# EAGLE design M220B (EAGLE 6.6.0)
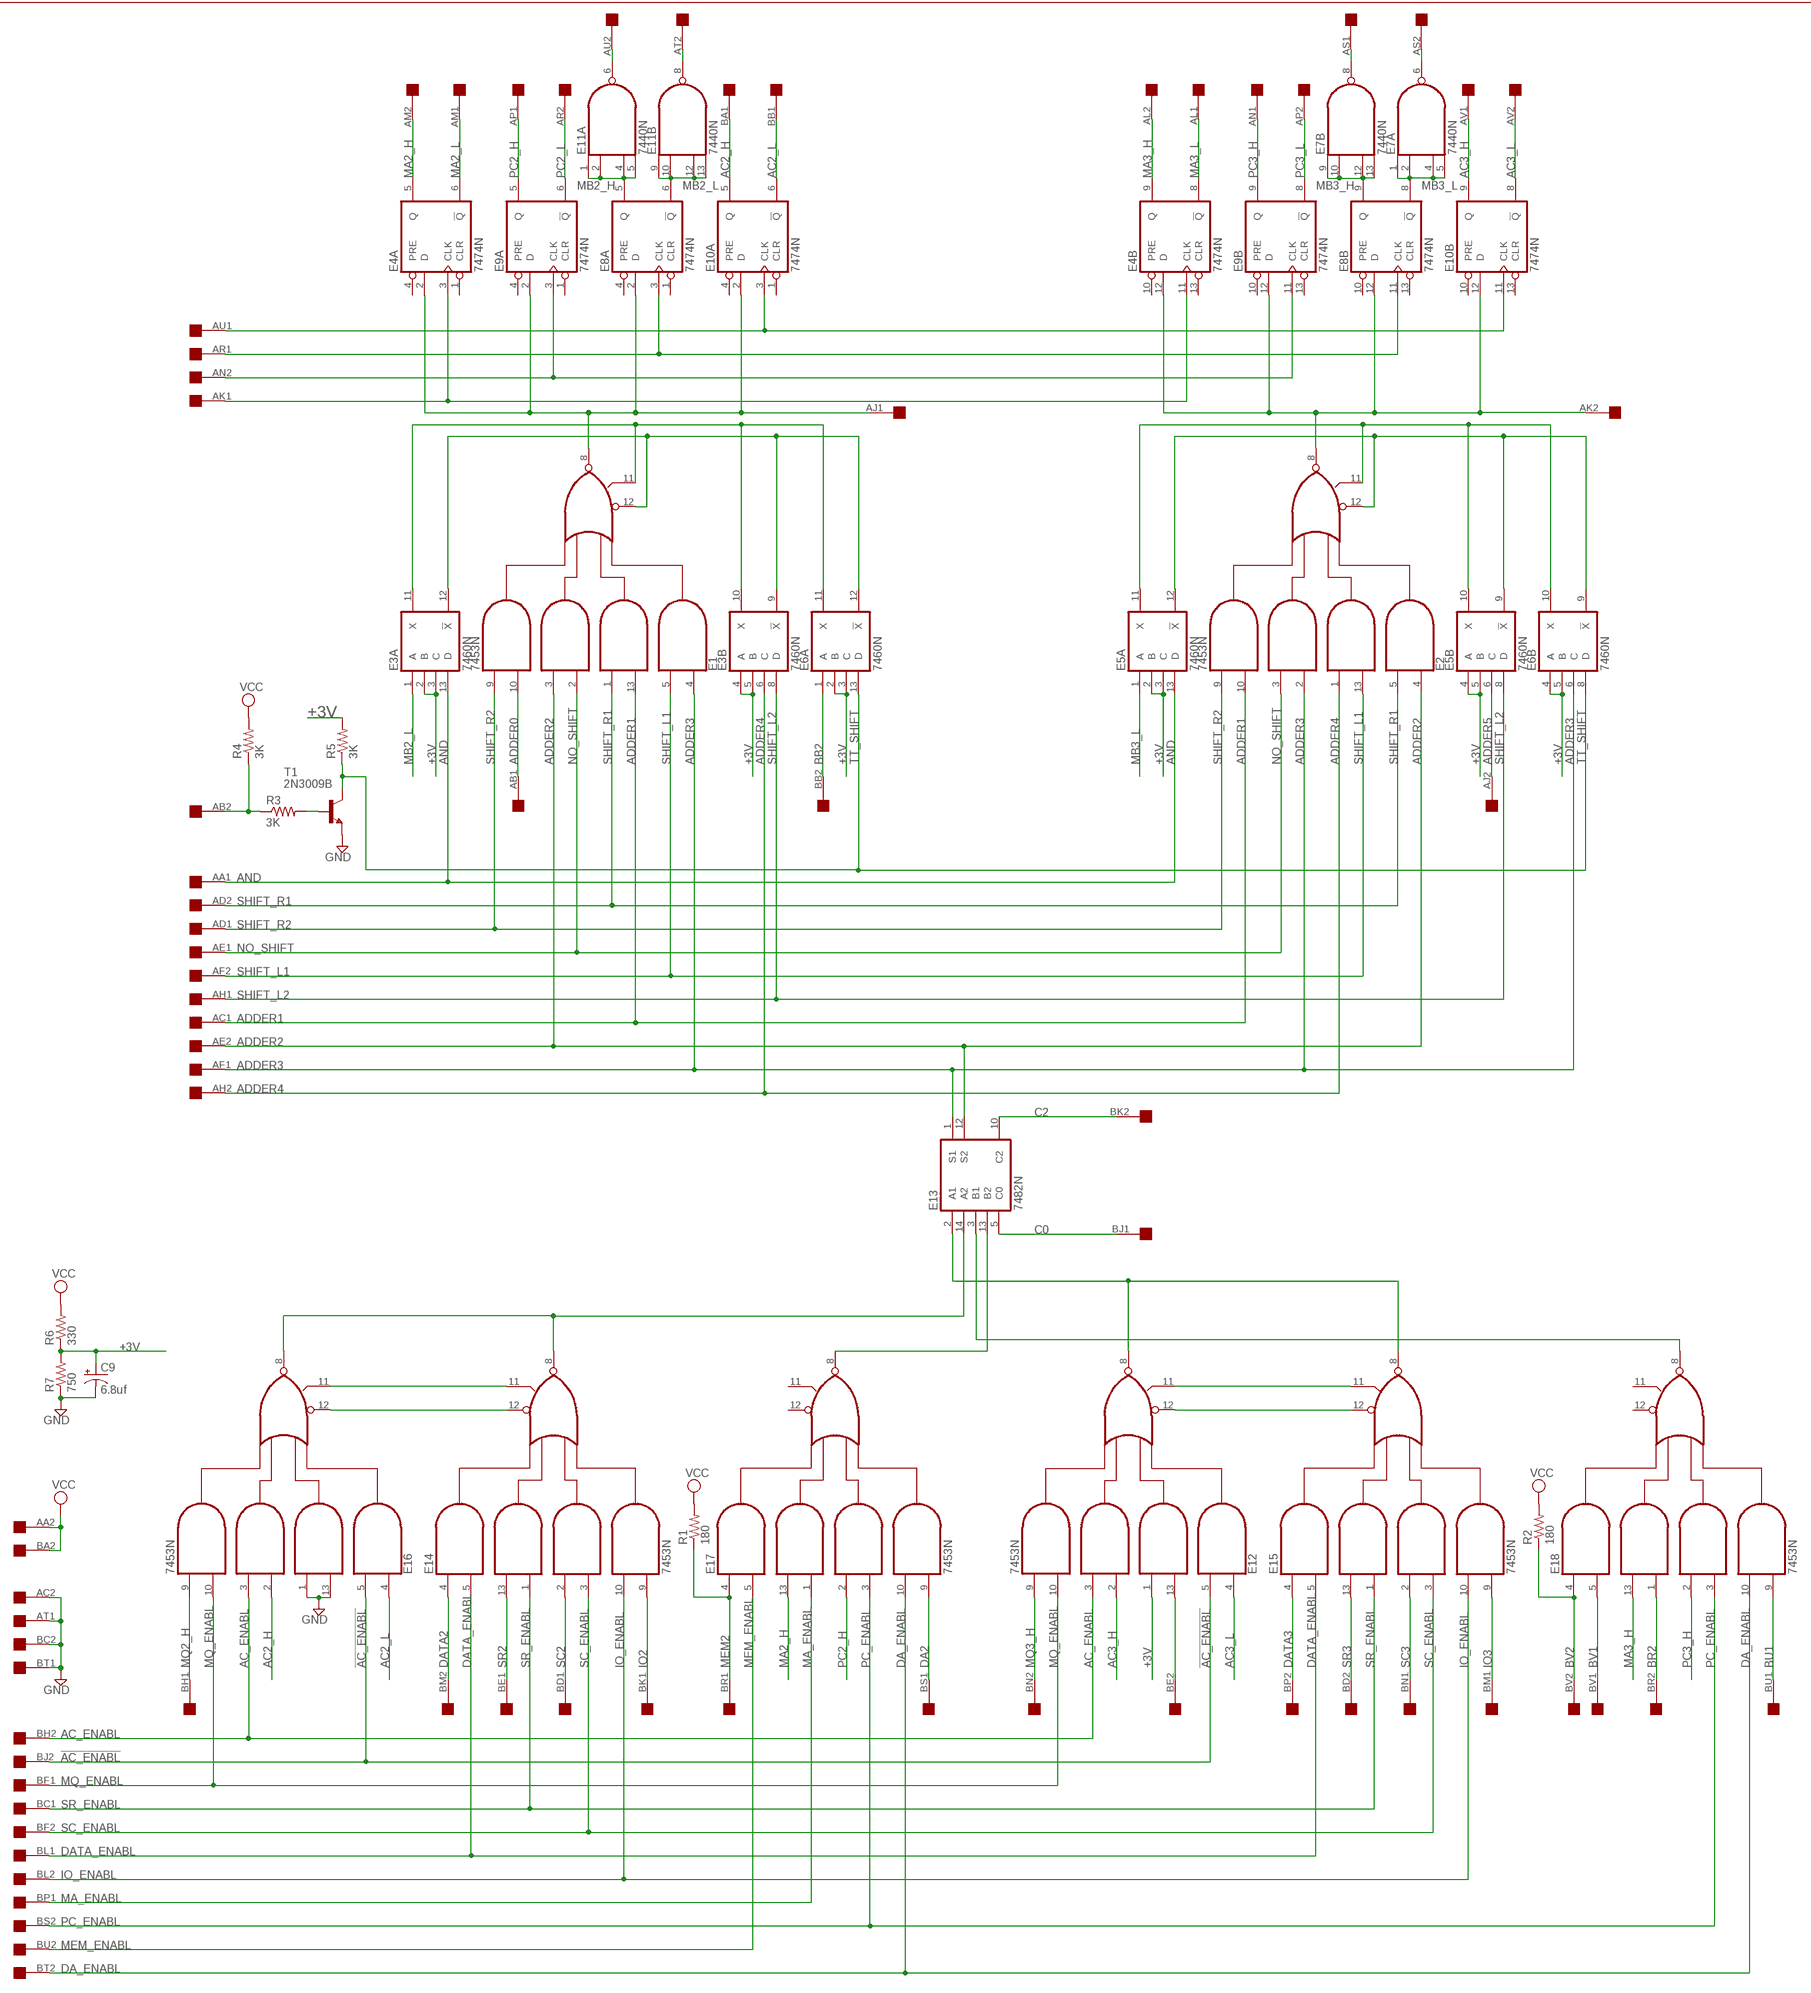
[diagram p0: schematic, sheet 1, part 1 of 2]
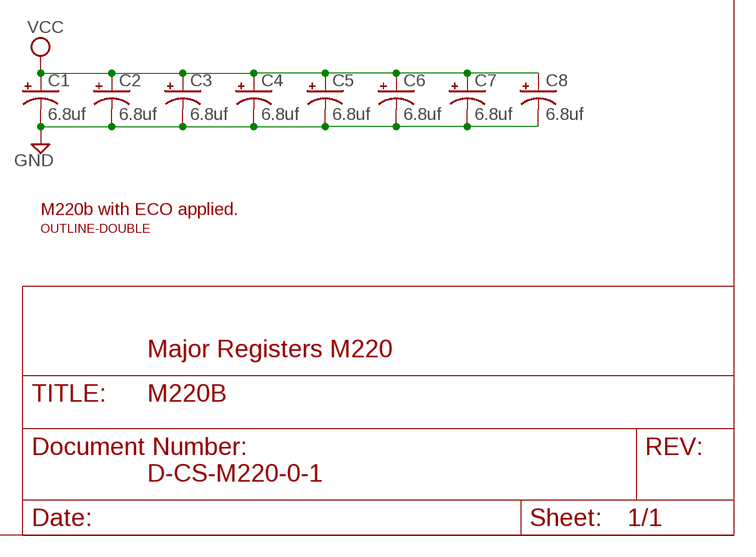
[diagram p1: schematic, sheet 1, part 2 of 2]

## Parts
C1  6.8uf  CPOL-USE15-5AXIAL  [E15-5]
C2  6.8uf  CPOL-USE15-5AXIAL  [E15-5]
C3  6.8uf  CPOL-USE15-5AXIAL  [E15-5]
C4  6.8uf  CPOL-USE15-5AXIAL  [E15-5]
C5  6.8uf  CPOL-USE15-5AXIAL  [E15-5]
C6  6.8uf  CPOL-USE15-5AXIAL  [E15-5]
C7  6.8uf  CPOL-USE15-5AXIAL  [E15-5]
C8  6.8uf  CPOL-USE15-5AXIAL  [E15-5]
C9  6.8uf  CPOL-USE15-5AXIAL  [E15-5]
E1  7453N  [DIL14]
E2  7453N  [DIL14]
E3  7460N  [DIL14]
E4  7474N  74S74N  [DIL14]
E5  7460N  [DIL14]
E6  7460N  [DIL14]
E7  7440N  74S20N  [DIL14]
E8  7474N  74S74N  [DIL14]
E9  7474N  74S74N  [DIL14]
E10  7474N  74S74N  [DIL14]
E11  7440N  74S20N  [DIL14]
E12  7453N  [DIL14]
E13  7482N  [DIL14]
E14  7453N  [DIL14]
E15  7453N  [DIL14]
E16  7453N  [DIL14]
E17  7453N  [DIL14]
E18  7453N  [DIL14]
R1  180  R-US_0207/10  [0207/10]
R2  180  R-US_0207/10  [0207/10]
R3  3K  R-US_0207/10  [0207/10]
R4  3K  R-US_0207/10  [0207/10]
R5  3K  R-US_0207/10  [0207/10]
R6  330  R-US_0207/10  [0207/10]
R7  750  R-US_0207/10  [0207/10]
T1  2N3009B  2N1613  [TO5]
U$1  DOUBLE  [EDGE-CON4]
U$2  OUTLINE-DOUBLE  [DOUBLE]

## Nets
!AC_ENABL: E12.5(I2) E16.5(I2) U$1.BJ2
!TT_SHIFT: R3.1 R4.1 U$1.AB2
+3V: C9.+ E3.2(A:B) E3.3(A:C) E3.4(B:A) E3.5(B:B) E5.2(A:B) E5.3(A:C) E5.4(B:A) E5.5(B:B) E6.2(A:B) E6.3(A:C) E6.4(B:A) E6.5(B:B) E12.1(I4) R5.2 R6.1 R7.2
AC2_H: E10.5(A:Q) E16.2(I5) U$1.BA1
AC2_L: E10.6(A:!Q) E16.4(I1) U$1.BB1
AC3_H: E10.9(B:Q) E12.2(I5) U$1.AV1
AC3_L: E10.8(B:!Q) E12.4(I1) U$1.AV2
AC_ENABL: E12.3(I6) E16.3(I6) U$1.BH2
ADDER0: E1.10(I7) U$1.AB1
ADDER1: E1.13(I3) E2.10(I7) U$1.AC1
ADDER2: E1.3(I6) E2.4(I1) E13.12(S2) U$1.AE2
ADDER3: E1.4(I1) E2.2(I5) E6.6(B:C) E13.1(S1) U$1.AF1
ADDER4: E2.1(I4) E3.6(B:C) U$1.AH2
ADDER5: E5.6(B:C) U$1.AJ2
AJ1: E1.8(O) E4.2(A:D) E8.2(A:D) E9.2(A:D) E10.2(A:D) U$1.AJ1
AK1: E4.3(A:CLK) E4.11(B:CLK) U$1.AK1
AK2: E2.8(O) E4.12(B:D) E8.12(B:D) E9.12(B:D) E10.12(B:D) U$1.AK2
AN2: E9.3(A:CLK) E9.11(B:CLK) U$1.AN2
AND: E3.13(A:D) E5.13(A:D) U$1.AA1
AR1: E8.3(A:CLK) E8.11(B:CLK) U$1.AR1
AS1: E7.8(B:O) U$1.AS1
AS2: E7.6(A:O) U$1.AS2
AT2: E11.8(B:O) U$1.AT2
AU1: E10.3(A:CLK) E10.11(B:CLK) U$1.AU1
AU2: E11.6(A:O) U$1.AU2
BB2: E6.1(A:A) U$1.BB2
BE2: E12.13(I3) U$1.BE2
BR2: E18.1(I4) U$1.BR2
BU1: E18.9(I8) U$1.BU1
BV1: E18.5(I2) U$1.BV1
BV2: E18.4(I1) R2.1 U$1.BV2
C0: E13.5(C0) U$1.BJ1
C2: E13.10(C2) U$1.BK2
DA2: E17.9(I8) U$1.BS1
DA_ENABL: E17.10(I7) E18.10(I7) U$1.BT2
DATA2: E14.4(I1) U$1.BM2
DATA3: E15.4(I1) U$1.BP2
DATA_ENABL: E14.5(I2) E15.5(I2) U$1.BL1
GND [Supply]: C1.- C2.- C3.- C4.- C5.- C6.- C7.- C8.- C9.- E16.1(I4) E16.13(I3) R7.1 T1.1(E) U$1.AC2 U$1.AT1 U$1.BC2 U$1.BT1
IO2: E14.9(I8) U$1.BK1
IO3: E15.9(I8) U$1.BM1
IO_ENABL: E14.10(I7) E15.10(I7) U$1.BL2
MA2_H: E4.5(A:Q) E17.13(I3) U$1.AM2
MA2_L: E4.6(A:!Q) U$1.AM1
MA3_H: E4.9(B:Q) E18.13(I3) U$1.AL2
MA3_L: E4.8(B:!Q) U$1.AL1
MA_ENABL: E17.1(I4) U$1.BP1
MB2_H: E8.5(A:Q) E11.1(A:I0) E11.2(A:I1) E11.4(A:I2) E11.5(A:I3)
MB2_L: E3.1(A:A) E8.6(A:!Q) E11.9(B:I0) E11.10(B:I1) E11.12(B:I2) E11.13(B:I3)
MB3_H: E7.9(B:I0) E7.10(B:I1) E7.12(B:I2) E7.13(B:I3) E8.9(B:Q)
MB3_L: E5.1(A:A) E7.1(A:I0) E7.2(A:I1) E7.4(A:I2) E7.5(A:I3) E8.8(B:!Q)
MEM2: E17.4(I1) R1.1 U$1.BR1
MEM_ENABL: E17.5(I2) U$1.BU2
MQ2_H: E16.9(I8) U$1.BH1
MQ3_H: E12.9(I8) U$1.BN2
MQ_ENABL: E12.10(I7) E16.10(I7) U$1.BF1
N$2: E12.12(I9) E15.12(I9)
N$3: R3.2 T1.2(B)
N$4: E12.11(I10) E15.11(I10)
N$5: E13.14(A2) E14.8(O) E16.8(O)
N$6: E14.11(I10) E16.11(I10)
N$7: E14.12(I9) E16.12(I9)
N$8: E12.8(O) E13.2(A1) E15.8(O)
N$9: E2.12(I9) E5.9(B:!X) E5.12(A:!X) E6.9(B:!X)
N$10: E1.12(I9) E3.9(B:!X) E3.12(A:!X) E6.12(A:!X)
N$11: E2.11(I10) E5.10(B:X) E5.11(A:X) E6.10(B:X)
N$12: E13.13(B2) E17.8(O)
N$13: E1.11(I10) E3.10(B:X) E3.11(A:X) E6.11(A:X)
N$14: E13.3(B1) E18.8(O)
NO_SHIFT: E1.2(I5) E2.3(I6) U$1.AE1
PC2_H: E9.5(A:Q) E17.2(I5) U$1.AP1
PC2_L: E9.6(A:!Q) U$1.AR2
PC3_H: E9.9(B:Q) E18.2(I5) U$1.AN1
PC3_L: E9.8(B:!Q) U$1.AP2
PC_ENABL: E17.3(I6) E18.3(I6) U$1.BS2
SC2: E14.2(I5) U$1.BD1
SC3: E15.2(I5) U$1.BN1
SC_ENABL: E14.3(I6) E15.3(I6) U$1.BF2
SHIFT_L1: E1.5(I2) E2.13(I3) U$1.AF2
SHIFT_L2: E3.8(B:D) E5.8(B:D) U$1.AH1
SHIFT_R1: E1.1(I4) E2.5(I2) U$1.AD2
SHIFT_R2: E1.9(I8) E2.9(I8) U$1.AD1
SR2: E14.13(I3) U$1.BE1
SR3: E15.13(I3) U$1.BD2
SR_ENABL: E14.1(I4) E15.1(I4) U$1.BC1
TT_SHIFT: E6.8(B:D) E6.13(A:D) R5.1 T1.3(C)
VCC [Supply]: C1.+ C2.+ C3.+ C4.+ C5.+ C6.+ C7.+ C8.+ R1.2 R2.2 R4.2 R6.2 U$1.AA2 U$1.BA2
Unconnected: E1.6(SPARE) E2.6(SPARE) E4.1(A:CLR) E4.4(A:PRE) E4.10(B:PRE) E4.13(B:CLR) E8.1(A:CLR) E8.4(A:PRE) E8.10(B:PRE) E8.13(B:CLR) E9.1(A:CLR) E9.4(A:PRE) E9.10(B:PRE) E9.13(B:CLR) E10.1(A:CLR) E10.4(A:PRE) E10.10(B:PRE) E10.13(B:CLR) E12.6(SPARE) E13.6 E13.7 E13.8 E13.9 E14.6(SPARE) E15.6(SPARE) E16.6(SPARE) E17.6(SPARE) E17.11(I10) E17.12(I9) E18.6(SPARE) E18.11(I10) E18.12(I9)

## Notes on the sheet
- M220b with ECO applied.
- Major Registers M220
- D-CS-M220-0-1

## Power pins joined to a net without a drawn wire
GND: E1.7(GND) E2.7(GND) E3.7(P:GND) E4.7(P:GND) E5.7(P:GND) E6.7(P:GND) E7.7(P:GND) E8.7(P:GND) E9.7(P:GND) E10.7(P:GND) E11.7(P:GND) E12.7(GND) E13.11(GND) E14.7(GND) E15.7(GND) E16.7(GND) E17.7(GND) E18.7(GND)
VCC: E1.14(VCC) E2.14(VCC) E3.14(P:VCC) E4.14(P:VCC) E5.14(P:VCC) E6.14(P:VCC) E7.14(P:VCC) E8.14(P:VCC) E9.14(P:VCC) E10.14(P:VCC) E11.14(P:VCC) E12.14(VCC) E13.4(VCC) E14.14(VCC) E15.14(VCC) E16.14(VCC) E17.14(VCC) E18.14(VCC)

## Library data of the parts
C1-C8 = dec-con:CPOL-USE15-5AXIAL: 0.5" veresion of an electrolytic
C9 = rcl:CPOL-US: POLARIZED CAPACITOR, American symbol
E1 E2 E12 E14-E18 = dec-con:74*53: 4-2-3-2 input AND OR INVERTER gates
E3 E5 E6 = 74xx-us:74*60: Dual 4-input EXPANDER
E4 E8-E10 = 74xx-us:74*74: Dual D type positive edge triggered FLIP FLOP, preset and clear
E7 E11 = 74xx-us:74*20: Dual 4-input NAND gate
E13 = dec-con:74*82: 2-bit binary full ADDER Has the wrong GND pin in other libraries.
R1-R7 = rcl:R-US_: RESISTOR, American symbol
T1 = transistor:2N1613: NPN TRANSISTOR
U$1 = dec-con:DOUBLE: Double-Height DEC board
U$2 = dec-con:OUTLINE-*: Board outlines for DEC boards.

## Net classes
1 Supply: width 0.813 mm

## Board
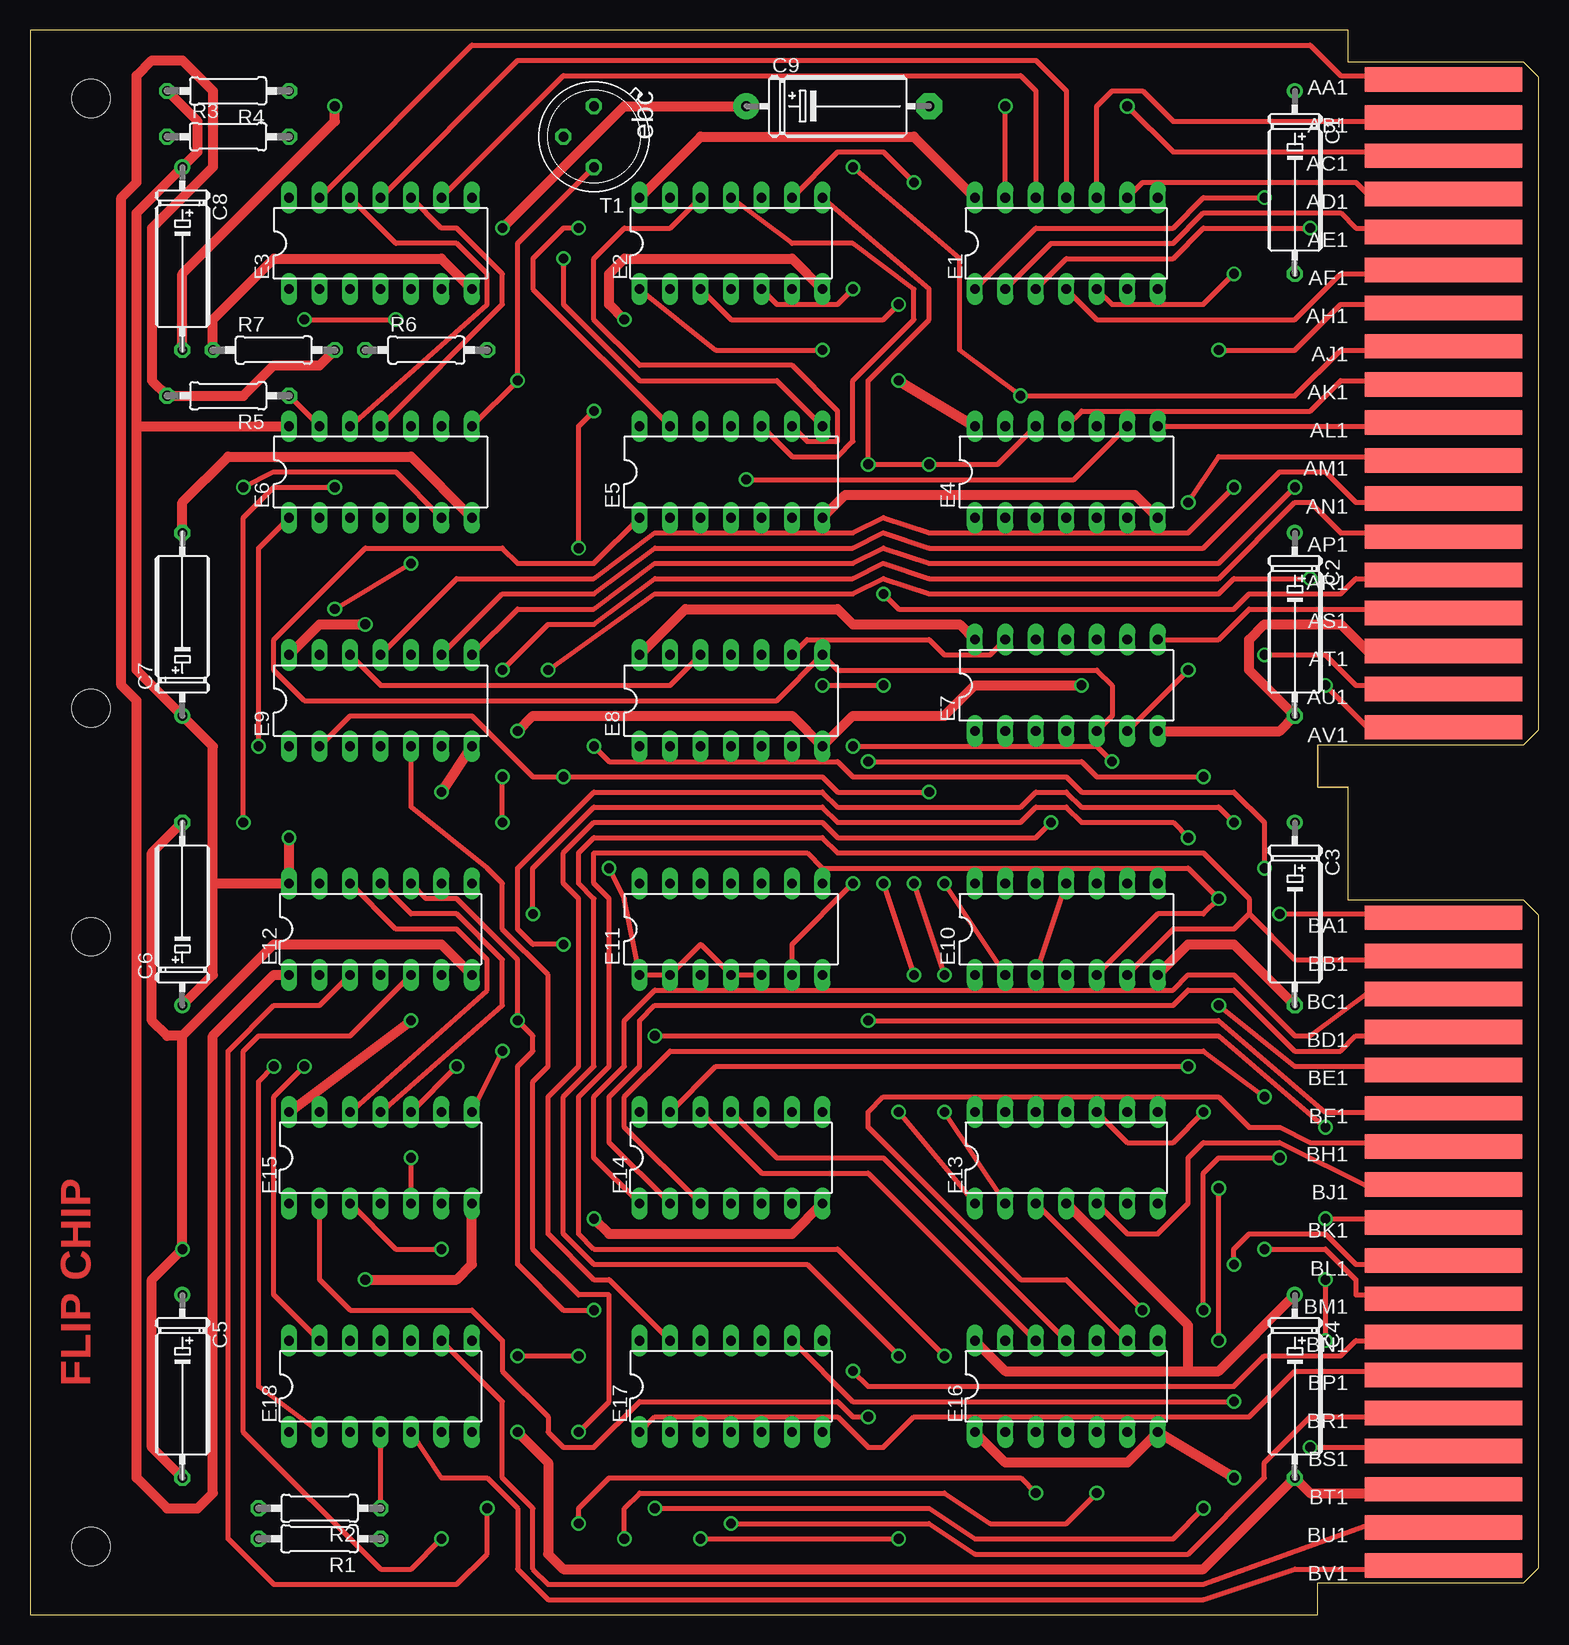
[diagram p2: board, top side]
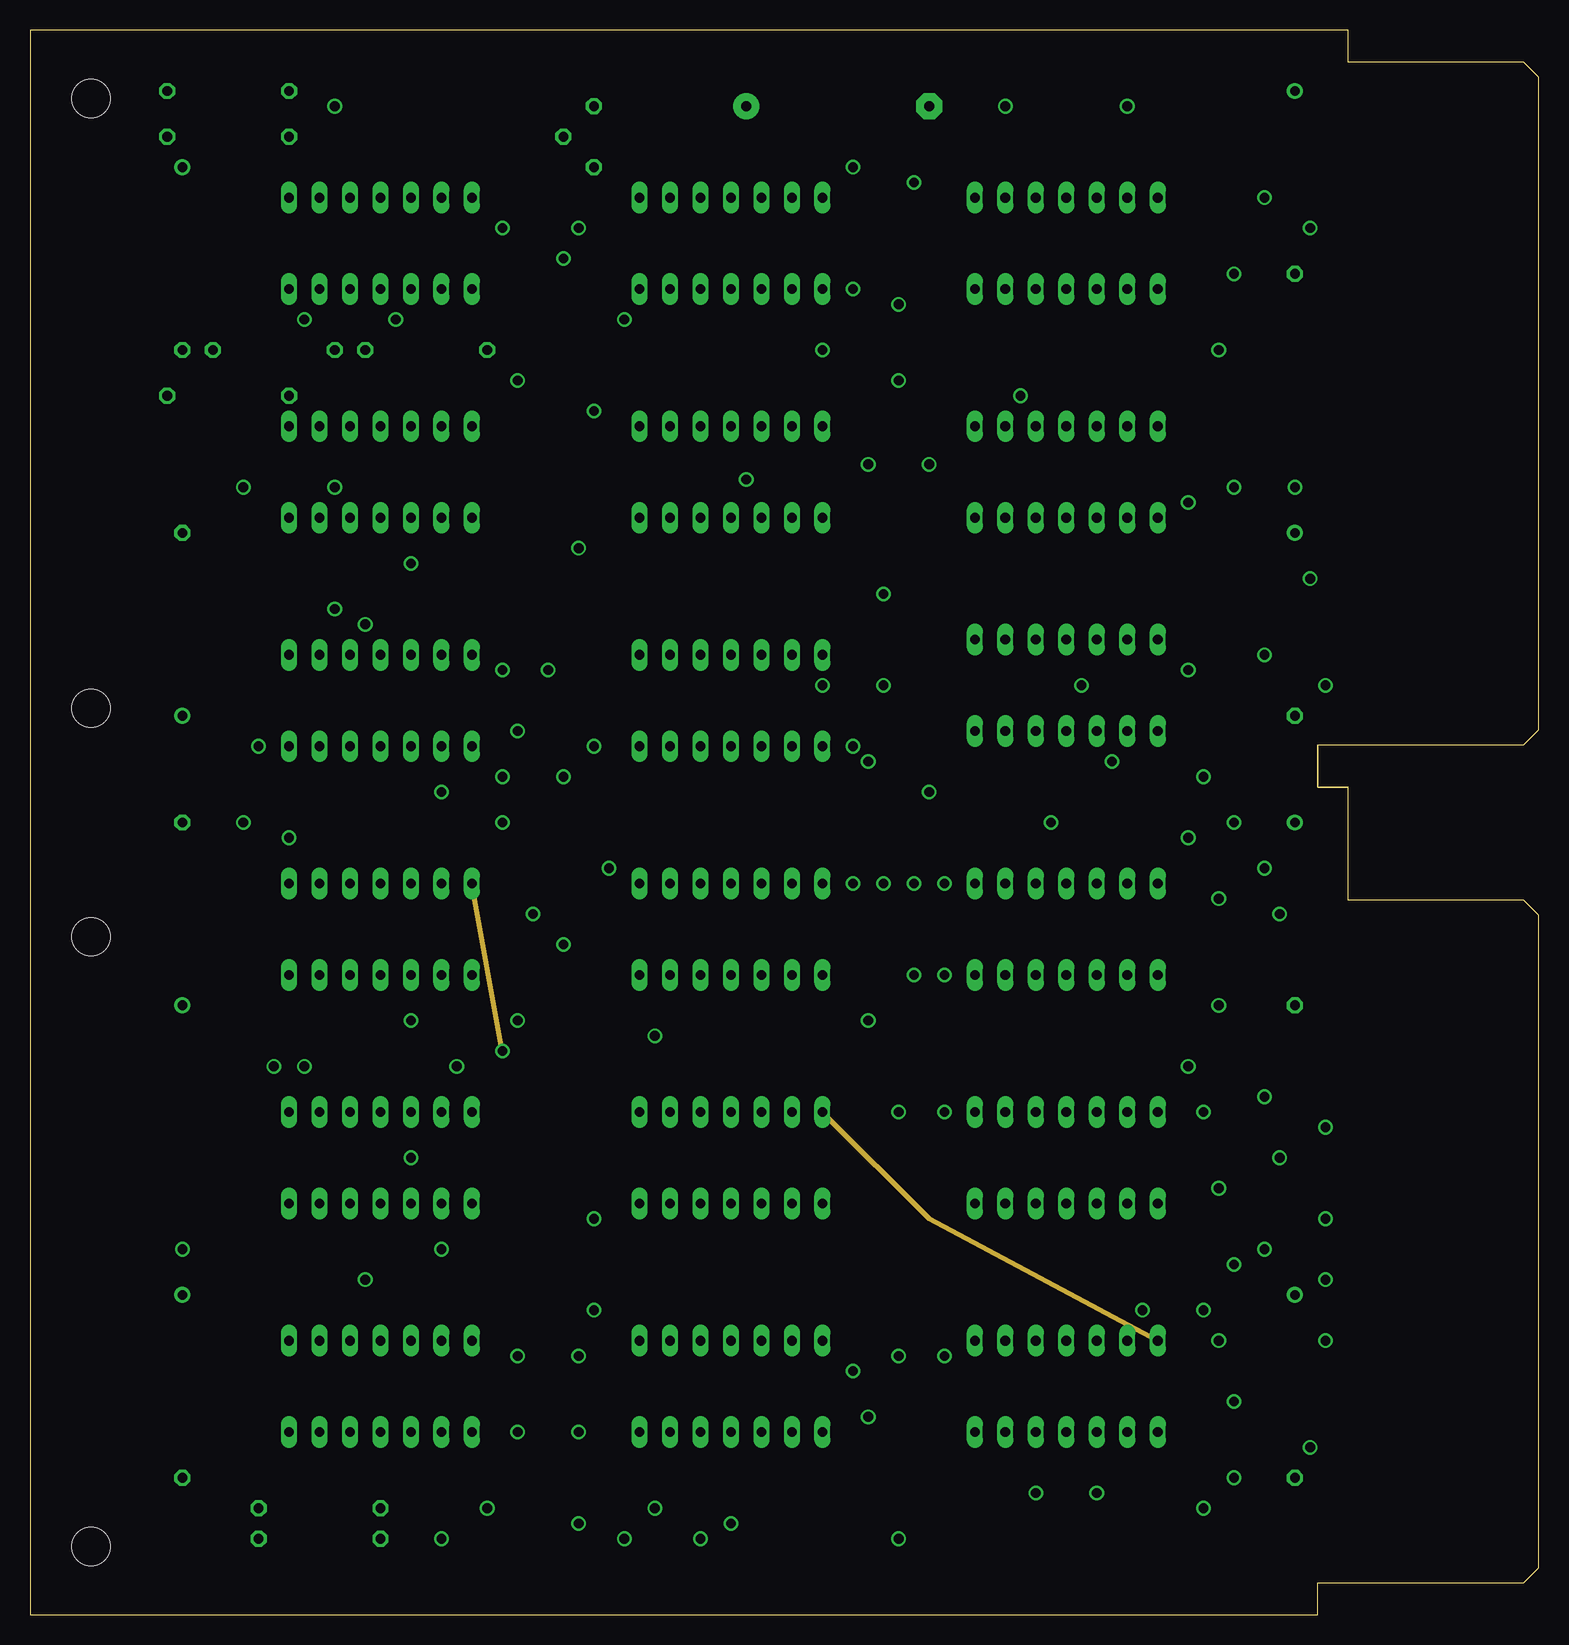
[diagram p3: board, inner layer ECO]
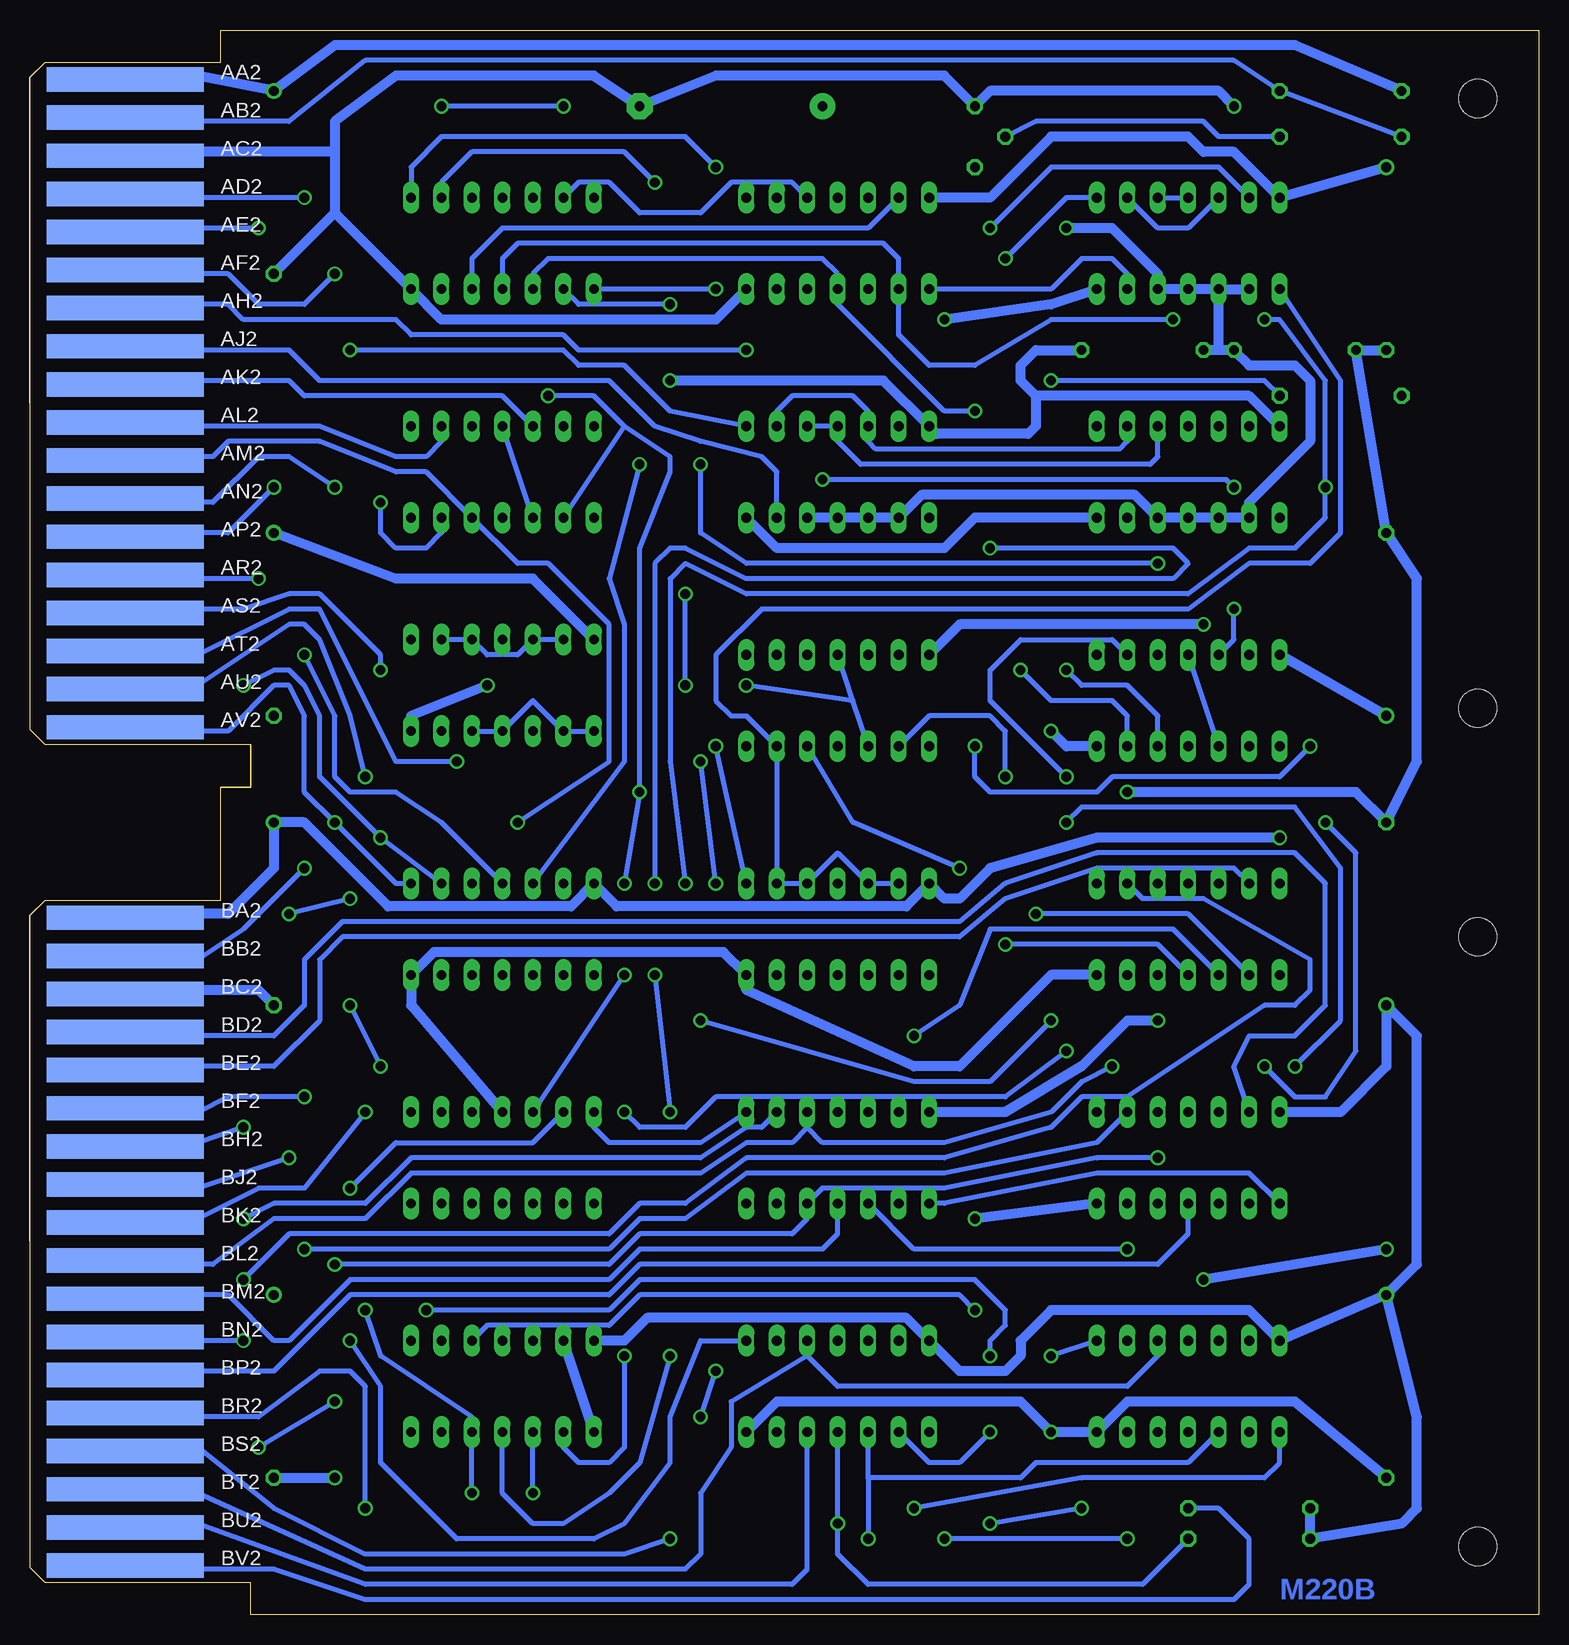
[diagram p4: board, bottom side, seen from below]

Size 125.73 x 132.08 mm. Coordinates in mm from the lower left corner, seen from the top.
Copper layers (1+15+16): Top 0.035mm / dielectric 1.5mm / ECO 0.035mm / dielectric 0.2mm / Bottom 0.035mm
Design rules "16mils *": minimum track width 16mil, minimum drill 32mil, track to track 15mil, track to pad 10mil, pad to pad 10mil, via to via 10mil, smd to smd 10mil, copper to edge 13mil, drill to drill 10mil, minimum pad ring 10mil, minimum via ring 8mil, stop-mask expansion 0mil, vias tented up to drill 0mil, thermal gap 10mil

### Footprints (pad centres in the part's own frame; a part is rotated, then mirrored left to right if it is on the bottom)
E15-5 = drill 0.813: + -7.62,0 | drill 0.813 octagon: - 7.62,0
E15-5' = drill 0.813 pad 2.159: + -7.62,0 | drill 0.813 pad 2.159 octagon: - 7.62,0
DIL14 = drill 0.813 long: 1 -7.62,-3.81; 2 -5.08,-3.81; 3 -2.54,-3.81; 4 0,-3.81; 5 2.54,-3.81; 6 5.08,-3.81; 7 7.62,-3.81; 8 7.62,3.81; 9 5.08,3.81; 10 2.54,3.81; 11 0,3.81; 12 -2.54,3.81; 13 -5.08,3.81; 14 -7.62,3.81
0207/10 = drill 0.813 octagon: 1 -5.08,0; 2 5.08,0
TO5 = drill 0.813 octagon: 1 0,-2.54; 2 2.54,0; 3 0,2.54
EDGE-CON4 = smd 13.106 x 2.032: AA1 7.938,4.128; AB1 7.938,7.303; AC1 7.938,10.477; AD1 7.938,13.652; AE1 7.938,16.828; AF1 7.938,20.003; AH1 7.938,23.177; AJ1 7.938,26.352; AK1 7.938,29.527; AL1 7.938,32.703; AM1 7.938,35.877; AN1 7.938,39.053; AP1 7.938,42.227; AR1 7.938,45.403; AS1 7.938,48.578; AT1 7.938,51.752; AU1 7.938,54.928; AV1 7.938,58.102; BA1 7.938,73.978; BB1 7.938,77.153; BC1 7.938,80.328; BD1 7.938,83.502; BE1 7.938,86.677; BF1 7.938,89.853; BH1 7.938,93.028; BJ1 7.938,96.203; BK1 7.938,99.377; BL1 7.938,102.552; BM1 7.938,105.728; BN1 7.938,108.903; BP1 7.938,112.078; BR1 7.938,115.252; BS1 7.938,118.427; BT1 7.938,121.603; BU1 7.938,124.778; BV1 7.938,127.953 | smd 13.106 x 2.032 bottom: AA2 7.938,4.128; AB2 7.938,7.303; AC2 7.938,10.477; AD2 7.938,13.652; AE2 7.938,16.828; AF2 7.938,20.003; AH2 7.938,23.177; AJ2 7.938,26.352; AK2 7.938,29.527; AL2 7.938,32.703; AM2 7.938,35.877; AN2 7.938,39.053; AP2 7.938,42.227; AR2 7.938,45.403; AS2 7.938,48.578; AT2 7.938,51.752; AU2 7.938,54.928; AV2 7.938,58.102; BA2 7.938,73.978; BB2 7.938,77.153; BC2 7.938,80.328; BD2 7.938,83.502; BE2 7.938,86.677; BF2 7.938,89.853; BH2 7.938,93.028; BJ2 7.938,96.203; BK2 7.938,99.377; BL2 7.938,102.552; BM2 7.938,105.728; BN2 7.938,108.903; BP2 7.938,112.078; BR2 7.938,115.252; BS2 7.938,118.427; BT2 7.938,121.603; BU2 7.938,124.778; BV2 7.938,127.953
DOUBLE = hole 3.175: 120.65,56.515; 120.65,5.715; 120.65,75.565; 120.65,126.365

### Placement (x,y rotation side)
C1  105.41,119.38 270 top
C2  105.41,82.55 270 top
C3  105.41,58.42 270 top
C4  105.41,19.05 270 top
C5  12.7,19.05 270 top
C6  12.7,58.42 90 top
C7  12.7,82.55 90 top
C8  12.7,113.03 270 top
C9  6.8uf  [E15-5']  67.31,125.73 0 top
E1  86.36,114.3 0 top
E2  58.42,114.3 0 top
E3  29.21,114.3 0 top
E4  86.36,95.25 0 top
E5  58.42,95.25 0 top
E6  29.21,95.25 0 top
E7  86.36,77.47 0 top
E8  58.42,76.2 0 top
E9  29.21,76.2 0 top
E10  86.36,57.15 0 top
E11  58.42,57.15 0 top
E12  29.21,57.15 0 top
E13  86.36,38.1 0 top
E14  58.42,38.1 0 top
E15  29.21,38.1 0 top
E16  86.36,19.05 0 top
E17  58.42,19.05 0 top
E18  29.21,19.05 0 top
R1  24.13,6.35 180 top
R2  24.13,8.89 180 top
R3  16.51,123.19 0 top
R4  16.51,127 180 top
R5  16.51,101.6 180 top
R6  33.02,105.41 0 top
R7  20.32,105.41 0 top
T1  46.99,123.19 180 top
U$1  125.73,132.08 180 top
U$2  125.73,132.08 180 top
U$3  [FLIPCHIP]  0,0 0 top

### Tracks (layer width: path | path; a pad name or v marks a point on that pad's centre or on a via)
!AC_ENABL  (via drill 0.81)
  Top 0.406: v88.9,10.16 86.36,7.62 80.01,7.62 76.2,10.16 50.8,10.16 49.53,8.89 v49.53,6.35 | v34.29,6.35 31.75,3.81 29.21,3.81 17.78,15.24 17.78,46.99 19.05,48.26 26.67,48.26 E12.5 | v104.14,38.1 99.06,38.1 97.79,36.83 v97.79,25.4
  Bottom 0.406: v88.9,10.16 E16.5 88.9,16.51 96.52,21.59 v97.79,25.4 | U$1.BJ2 116.84,35.56 111.76,35.56 v104.14,38.1 | v34.29,6.35 v49.53,6.35
!TT_SHIFT
  Bottom 0.406: R3.1 R4.1 25.4,129.54 97.79,129.54 104.14,124.46 115.57,124.46
  Bottom 0.813: 115.57,124.46 U$1.AB2
+3V  (via drill 0.81)
  Top 0.813: C9.+ 49.53,125.73 v39.37,115.57 | R7.2 24.13,104.14 20.32,104.14 17.78,101.6 R5.2 10.16,102.87 10.16,115.57 15.24,120.65 15.24,127 12.7,129.54 10.16,129.54 8.89,128.27 8.89,119.38 7.62,118.11 7.62,77.47 8.89,76.2 8.89,11.43 11.43,8.89 13.97,8.89 15.24,10.16 15.24,48.26 20.32,53.34 E12.1
  Bottom 0.813: v39.37,115.57 35.56,115.57 31.75,111.76 E3.5 E3.4 E3.3 | E3.3 E3.2 | 26.67,105.41 R7.2 24.13,104.14 20.32,104.14 19.05,102.87 19.05,97.79 24.13,92.71 E6.2 E6.3 E6.4 E6.5 33.66,93.34 51.44,93.34 E5.2 E5.3 E5.4 E5.5 | 26.67,105.41 R6.1 | 26.67,105.41 E3.3
AC2_H  (via drill 0.81)
  Top 0.406: U$1.BA1 116.84,58.42 v104.14,58.42 | v76.2,21.59 67.31,30.48 46.99,30.48 45.72,31.75 45.72,43.18 48.26,45.72 48.26,59.69 46.99,60.96 46.99,63.5 64.77,63.5 66.04,62.23 96.52,62.23 v99.06,59.69 97.79,58.42 93.98,58.42 E10.5
  Bottom 0.406: E16.2 81.28,13.97 80.01,12.7 77.47,12.7 76.2,13.97 v76.2,21.59 | v99.06,59.69 v104.14,58.42
AC2_L  (via drill 0.81)
  Top 0.406: U$1.BB1 116.84,54.61 105.41,54.61 101.6,58.42 | 101.6,58.42 101.6,59.69 97.79,63.5 67.31,63.5 66.04,64.77 46.99,64.77 45.72,63.5 45.72,60.96 46.99,59.69 46.99,45.72 44.45,43.18 44.45,31.75 46.99,29.21 64.77,29.21 v72.39,21.59 | E10.6 95.25,57.15 100.33,57.15 101.6,58.42
  Bottom 0.406: E16.4 86.36,10.16 83.82,7.62 81.28,7.62 77.47,10.16 74.93,12.7 v72.39,21.59
AC3_H  (via drill 0.81)
  Top 0.406: U$1.AV1 117.67,73.66 111.76,73.66 v107.95,77.47 | v96.52,64.77 95.25,66.04 87.63,66.04 86.36,67.31 83.82,67.31 82.55,66.04 67.31,66.04 66.04,67.31 46.99,67.31 41.91,62.23 v41.91,58.42
  Bottom 0.406: E10.9 v96.52,64.77 101.6,69.85 101.6,74.93 102.87,77.47 104.14,78.74 105.41,78.74 v107.95,77.47 | E12.2 29.21,58.42 v41.91,58.42
AC3_L  (via drill 0.81)
  Top 0.406: v100.33,66.04 99.06,67.31 87.63,67.31 86.36,68.58 83.82,68.58 82.55,67.31 67.31,67.31 66.04,68.58 46.99,68.58 40.64,62.23 40.64,57.15 41.91,55.88 v44.45,55.88
  Bottom 0.406: U$1.AV2 117.23,74.05 116.84,73.66 109.22,73.66 105.41,77.47 104.14,77.47 102.87,74.93 102.87,68.58 v100.33,66.04 95.25,60.96 E10.8 | E12.4 31.75,55.88 v44.45,55.88
AC_ENABL  (via drill 0.81)
  Top 0.406: v83.82,10.16 82.55,11.43 48.26,11.43 45.72,8.89 v45.72,7.62 | E12.3 24.13,50.8 20.32,50.8 16.51,46.99 16.51,6.35 20.32,2.54 35.56,2.54 38.1,5.08 v38.1,8.89 | v52.07,48.26 99.06,48.26 v107.95,40.64
  Bottom 0.406: E12.3 30.48,57.15 45.72,57.15 48.26,50.8 v52.07,48.26 | v83.82,10.16 E16.3 | U$1.BH2 116.84,39.37 111.76,39.37 v107.95,40.64 | v38.1,8.89 v45.72,7.62
ADDER0
  Top 0.406: 116.84,124.46 95.25,124.46 92.71,127 90.17,127 88.9,125.73 E1.10
  Top 0.813: 116.84,124.46 U$1.AB1
ADDER1  (via drill 0.81)
  Top 0.406: E1.13 v81.28,125.73 | U$1.AC1 116.84,121.92 95.25,121.92 v91.44,125.73
  Bottom 0.406: v81.28,125.73 v91.44,125.73 | E1.13 80.01,119.38 77.47,119.38 74.93,116.84 69.85,116.84 67.31,119.38 62.23,119.38 E2.10
ADDER2  (via drill 0.81)
  Top 0.406: v46.99,100.33 45.72,99.06 v45.72,88.9 | v106.68,115.57 97.79,115.57 95.25,113.03 86.36,113.03 E1.3 | v73.66,60.96 v76.2,53.34
  Bottom 0.406: E1.3 83.82,111.76 82.55,113.03 59.69,113.03 58.42,111.76 E2.4 58.42,109.22 49.53,100.33 v46.99,100.33 | U$1.AE2 114.63,115.24 114.3,115.57 v106.68,115.57 | v76.2,53.34 E13.12 | v45.72,88.9 30.48,88.9 29.21,87.63 30.48,86.36 66.04,86.36 71.12,88.9 72.39,88.9 73.66,87.63 v73.66,60.96
ADDER3  (via drill 0.81)
  Top 0.406: v22.86,107.95 v30.48,107.95 | U$1.AF1 115.57,111.76 109.22,111.76 105.41,107.95 88.9,107.95 E1.4 | E6.6 30.48,95.25 20.32,95.25 v17.78,93.98 | v71.12,60.96 v73.66,53.34 | v72.39,41.91 E13.1
  Bottom 0.406: E1.4 86.36,113.03 85.09,114.3 54.61,114.3 53.34,113.03 E2.2 53.34,106.68 50.8,104.14 46.99,104.14 40.64,107.95 v30.48,107.95 | v22.86,107.95 21.59,107.95 17.78,102.87 v17.78,93.98 17.78,91.44 20.32,88.9 24.13,88.9 29.21,85.09 66.04,85.09 71.12,87.63 72.39,86.36 72.39,71.12 v71.12,60.96 | v73.66,53.34 v72.39,41.91
ADDER4  (via drill 0.81)
  Top 0.406: v66.04,105.41 57.15,105.41 E2.1
  Bottom 0.406: E3.6 34.29,111.76 35.56,113.03 38.1,113.03 40.64,110.49 E2.1 | U$1.AH2 115.9,108.89 115.57,109.22 109.22,109.22 107.95,107.95 95.25,107.95 93.98,106.68 81.28,106.68 80.01,105.41 v66.04,105.41
ADDER5
  Bottom 0.406: U$1.AJ2 117.17,105.74 116.84,105.41 104.14,105.41 101.6,102.87 77.47,102.87 73.66,99.06 69.85,97.79 64.77,96.52 63.5,95.25 E5.6
AJ1  (via drill 0.81)
  Top 0.406: v68.58,120.65 77.47,113.03 77.47,105.41 v82.55,101.6 105.41,101.6 109.22,105.41 116.84,105.41 U$1.AJ1 | v74.93,68.58 67.31,68.58 66.04,69.85 v44.45,69.85 41.91,69.85 36.83,74.93 26.67,74.93 E9.2 | v76.2,60.96 E10.2
  Bottom 0.406: E1.8 93.98,120.65 91.44,123.19 71.12,123.19 v68.58,120.65 | E8.2 50.8,74.93 45.72,74.93 44.45,73.66 v44.45,69.85 | 76.2,99.06 E4.2 | 76.2,99.06 78.74,101.6 v82.55,101.6 | 76.2,99.06 72.39,96.52 72.39,95.25 74.93,88.9 v74.93,68.58 v76.2,60.96
AK1
  Top 0.406: U$1.AK1 116.84,102.87 109.22,102.87 106.68,100.33 87.63,100.33 E4.11
  Bottom 0.406: E4.3 E4.11
AK2  (via drill 0.81)
  Top 0.406: v25.4,83.82 v31.75,87.63 | E4.12 80.64,95.89 v74.93,95.89 v69.85,95.89 69.85,102.87 74.93,107.95 74.93,110.49 E2.8 | E8.12 53.34,77.47 29.21,77.47 E9.12
  Bottom 0.406: U$1.AK2 115.88,102.56 115.57,102.87 104.14,102.87 102.87,101.6 86.36,101.6 E4.12 | E9.12 25.4,81.28 v25.4,83.82 | E10.12 76.2,71.12 76.2,82.55 77.47,86.36 v74.93,95.89 | v31.75,87.63 66.04,87.63 69.85,90.17 v69.85,95.89
AN2  (via drill 0.81)
  Top 0.406: v100.33,93.98 96.52,90.17 74.93,90.17 71.12,91.44 68.58,90.17 52.07,90.17 46.99,86.36 35.56,86.36 E9.11
  Bottom 0.406: E9.3 E9.11 | U$1.AN2 115.9,93.04 115.57,92.71 110.49,92.71 106.68,96.52 104.14,96.52 v100.33,93.98
AND  (via drill 0.81)
  Top 0.406: U$1.AA1 117.24,127.87 116.84,128.27 109.22,128.27 106.68,130.81 36.83,130.81 E3.13 | E5.13 41.91,110.49 41.91,113.03 44.45,115.57 v45.72,115.57
  Bottom 0.406: E3.13 26.67,120.65 40.64,120.65 v45.72,115.57
AR1  (via drill 0.81)
  Top 0.406: v66.04,77.47 v71.12,77.47 | v71.12,85.09 72.39,83.82 100.33,83.82 101.6,85.09 109.22,85.09 110.49,86.36 116.84,86.36 U$1.AR1
  Bottom 0.406: E8.3 57.15,76.2 | 57.15,76.2 E8.11 | 57.15,76.2 v66.04,77.47 | v71.12,77.47 v71.12,85.09
AS1
  Top 0.406: U$1.AS1 116.84,83.82 101.6,83.82 99.06,81.28 E7.8
AS2  (via drill 0.81)
  Top 0.406: E7.6 v96.52,78.74
  Bottom 0.406: U$1.AS2 117.14,83.52 116.84,83.82 107.95,83.82 104.14,85.09 101.6,85.09 96.52,80.01 v96.52,78.74
AT2  (via drill 0.81)
  Top 0.406: v90.17,71.12 88.9,72.39 v68.58,72.39
  Bottom 0.406: E11.8 v68.58,72.39 | U$1.AT2 116.84,80.01 111.76,80.01 104.14,83.82 101.6,83.82 95.25,71.12 v90.17,71.12
AU1  (via drill 0.81)
  Top 0.406: U$1.AU1 117.71,77.47 110.49,77.47 107.95,80.01 v102.87,80.01 | E10.3 E10.11
  Bottom 0.406: v102.87,80.01 100.33,74.93 100.33,69.85 99.06,68.58 95.25,68.58 91.44,66.04 E10.11
AU2  (via drill 0.81)
  Top 0.406: v97.79,69.85 88.9,69.85 87.63,71.12 v69.85,71.12 | v68.58,60.96 63.5,55.88 E11.6
  Bottom 0.406: U$1.AU2 116.84,77.47 111.76,77.47 104.14,82.55 102.87,82.55 101.6,81.28 99.06,74.93 v97.79,69.85 | v68.58,60.96 v69.85,71.12
BB2  (via drill 0.81)
  Top 0.406: E6.1 19.05,88.9 v19.05,72.39 | v46.99,72.39 48.26,71.12 67.31,71.12 68.58,69.85 86.36,69.85 87.63,68.58 100.33,68.58 102.87,66.04 v102.87,62.23
  Bottom 0.406: U$1.BB2 116.84,54.61 111.76,54.61 107.95,57.15 v102.87,62.23 | v19.05,72.39 21.59,69.85 35.56,69.85 36.83,68.58 45.72,68.58 46.99,69.85 v46.99,72.39
BE2
  Bottom 0.406: U$1.BE2 116.84,45.72 105.41,45.72 101.6,49.53 101.6,54.61 99.69,56.52 48.26,56.52 44.45,59.69 36.83,62.23 25.4,62.23 E12.13
BR2  (via drill 0.81)
  Top 0.406: v52.07,8.89 74.93,8.89 78.74,6.35 95.25,6.35 v97.79,8.89
  Bottom 0.406: E18.1 21.59,12.7 22.86,11.43 38.1,11.43 v52.07,8.89 | U$1.BR2 116.84,16.51 106.68,16.51 101.6,20.32 99.06,20.32 97.79,19.05 v97.79,8.89
BU1
  Top 0.406: U$1.BU1 116.84,7.62 111.76,7.62 97.79,2.54 43.18,2.54 41.91,3.81 41.91,8.89 39.37,11.43 39.37,17.78 E18.9
BV1
  Top 0.406: U$1.BV1 116.84,3.81 105.41,3.81 97.79,1.27 43.18,1.27 40.64,3.81 40.64,8.89 38.1,11.43 34.29,11.43 E18.5
BV2
  Top 0.406: R2.1 E18.4
  Bottom 0.406: U$1.BV2 117.23,4.2 116.84,3.81 105.41,3.81 97.79,1.27 25.4,1.27 24.13,2.54 24.13,6.35 26.67,8.89 R2.1
C0
  Top 0.406: U$1.BJ1 117.73,35.56 111.76,35.56 104.14,39.37 97.79,39.37 96.52,38.1 96.52,34.29 93.98,31.75 91.44,31.75 E13.5
C2  (via drill 0.81)
  Top 0.406: v97.79,41.91 95.25,39.37 91.44,39.37 E13.10
  Bottom 0.406: U$1.BK2 116.84,33.02 111.76,33.02 106.68,35.56 102.87,35.56 v97.79,41.91
DA2  (via drill 0.81)
  Top 0.406: U$1.BS1 116.84,13.97 v106.68,13.97 | v100.33,17.78 68.58,17.78 E17.9
  Bottom 0.406: v100.33,17.78 v106.68,13.97
DA_ENABL
  Bottom 0.406: U$1.BT2 116.84,10.16 111.76,10.16 97.79,3.81 71.12,3.81 69.85,5.08 69.85,10.16 67.31,13.97 67.31,17.78 60.96,21.59 | 60.96,21.59 E17.10 | E18.10 31.75,21.59 34.29,19.05 58.42,19.05 60.96,21.59
DATA2
  Bottom 0.406: U$1.BM2 116.84,26.67 109.22,26.67 105.41,22.86 104.14,22.86 99.06,27.94 77.47,27.94 74.93,30.48 59.69,30.48 58.42,31.75 E14.4
DATA3
  Bottom 0.406: U$1.BP2 115.57,20.32 105.41,20.32 99.06,26.67 77.47,26.67 74.93,29.21 31.75,29.21 29.21,31.75 E15.4
DATA_ENABL  (via drill 0.81)
  Top 0.406: E15.5 v31.75,38.1 | U$1.BL1 117.71,29.21 110.49,29.21 107.95,31.75 101.6,31.75 100.33,30.48 v100.33,29.21
  Bottom 0.406: v100.33,29.21 77.47,29.21 74.93,31.75 62.23,31.75 60.96,33.02 E14.5 59.69,35.56 49.53,35.56 36.83,38.1 v31.75,38.1
GND  (via drill 0.81)
  Top 0.813: v100.33,11.43 E16.7 91.44,12.7 81.28,12.7 E16.1 | U$1.BT1 116.84,10.16 106.68,10.16 C4.- 97.79,3.81 44.45,3.81 43.18,5.08 43.18,12.7 v40.64,15.24 | v46.99,33.02 48.26,31.75 63.5,31.75 E14.7 | v25.4,125.73 25.4,124.46 12.7,111.76 C8.- | E3.7 34.29,113.03 20.32,113.03 15.24,107.95 R7.1 | v34.29,68.58 E9.7 | v40.64,73.66 41.91,74.93 63.5,74.93 E8.7 68.58,74.93 76.2,74.93 78.74,77.47 v87.63,77.47 | C5.- 10.16,13.97 10.16,27.94 v12.7,30.48 12.7,48.26 | E15.7 36.83,29.21 35.56,27.94 v27.94,27.94 | E4.7 92.08,93.34 67.94,93.34 E5.7 | C7.- 12.7,92.71 16.51,96.52 31.75,96.52 E6.7 | v49.53,107.95 48.26,109.22 48.26,111.76 49.53,113.03 63.5,113.03 E2.7 | E7.7 104.14,73.66 C2.- 101.6,78.74 101.6,81.28 102.87,82.55 109.22,82.55 111.76,80.01 116.84,80.01 U$1.AT1 | E10.7 96.52,55.88 100.33,55.88 C3.- | E12.7 34.29,55.88 20.32,55.88 12.7,48.26 | 12.7,48.26 11.43,48.26 10.16,49.53 10.16,63.5 C6.-
  Bottom 0.813: C8.- R7.1 C7.- 10.16,86.36 10.16,71.12 C6.- 15.24,68.58 v34.29,68.58 | U$1.AC2 116.84,121.92 100.33,121.92 | 100.33,121.92 100.33,124.46 95.25,128.27 78.74,128.27 C9.- 68.58,128.27 49.53,128.27 T1.1 45.72,127 26.67,127 v25.4,125.73 | 100.33,116.84 C1.- | 100.33,121.92 100.33,116.84 | 100.33,116.84 E1.7 91.44,107.95 68.58,107.95 E2.7 | E3.7 40.64,109.22 v49.53,107.95 | E16.1 E16.13 | E7.7 93.98,74.93 v87.63,77.47 | E9.7 39.37,72.39 v40.64,73.66 | E12.7 40.64,53.34 48.26,45.72 52.07,45.72 66.04,52.07 E11.7 67.94,55.24 92.08,55.24 E10.7 93.98,50.8 E13.11 | U$1.BC2 116.84,52.07 106.68,52.07 C3.- | C4.- v100.33,11.43 | E17.7 63.5,17.78 43.18,17.78 v40.64,15.24 E18.7 34.29,17.78 20.32,17.78 C5.- | E15.7 v46.99,33.02 | E6.7 46.99,91.44 49.53,88.9 63.5,88.9 E5.7 | v12.7,30.48 v27.94,27.94
IO2  (via drill 0.81)
  Top 0.406: U$1.BK1 117.76,33.02 v107.95,33.02
  Bottom 0.406: E14.9 64.77,40.64 66.04,40.64 69.85,38.1 93.98,38.1 97.79,34.29 105.41,34.29 v107.95,33.02
IO3  (via drill 0.81)
  Top 0.406: U$1.BM1 117.71,26.67 110.49,26.67 110.49,27.94 107.95,30.48 v102.87,30.48
  Bottom 0.406: E15.9 36.83,39.37 49.53,36.83 66.04,36.83 71.12,33.02 74.93,33.02 77.47,30.48 v102.87,30.48
IO_ENABL  (via drill 0.81)
  Top 0.406: E15.10 v35.56,45.72
  Bottom 0.406: U$1.BL2 116.84,29.21 110.49,29.21 105.41,33.02 97.79,33.02 93.98,36.83 69.85,36.83 66.04,39.37 62.23,39.37 60.96,40.64 | 60.96,40.64 E14.10 | 60.96,40.64 59.69,39.37 49.53,39.37 40.64,41.91 38.1,44.45 v35.56,45.72
MA2_H  (via drill 0.81)
  Top 0.406: v85.09,66.04 83.82,64.77 67.31,64.77 66.04,66.04 46.99,66.04 44.45,63.5 44.45,60.96 45.72,59.69 45.72,45.72 43.18,43.18 43.18,31.75 46.99,27.94 48.26,27.94 E17.13
  Bottom 0.406: U$1.AM2 117.17,96.19 116.84,96.52 110.49,96.52 109.22,97.79 101.6,97.79 95.25,95.25 92.71,95.25 E4.5 85.09,87.63 82.55,87.63 77.47,82.55 77.47,71.12 v85.09,66.04
MA2_L  (via drill 0.81)
  Top 0.406: U$1.AM1 116.84,96.52 99.06,96.52 v96.52,92.71
  Bottom 0.406: E4.6 91.44,90.17 92.71,88.9 95.25,88.9 96.52,90.17 v96.52,92.71
MA3_H  (via drill 0.81)
  Top 0.406: E18.13 20.32,26.67 20.32,43.18 v22.86,45.72 | v17.78,66.04 17.78,91.44 20.32,93.98 v25.4,93.98 | v59.69,94.61 87,94.61 E4.9
  Bottom 0.406: U$1.AL2 117.17,99.39 116.84,99.06 101.6,99.06 95.25,96.52 92.71,96.52 91.44,97.79 E4.9 | v22.86,45.72 20.32,43.18 17.78,43.18 15.24,46.99 15.24,63.5 v17.78,66.04 | v25.4,93.98 26.04,94.61 v59.69,94.61
MA3_L
  Top 0.406: U$1.AL1 116.84,99.06 E4.8
MA_ENABL
  Top 0.406: U$1.BP1 116.84,20.32 105.41,20.32 101.6,16.51 73.66,16.51 71.12,13.97 69.85,13.97 67.31,16.51 52.07,16.51 E17.1
MB2_H  (via drill 0.81)
  Top 0.406: v48.26,62.23 49.53,59.69 E11.1 E11.2 55.88,55.88 E11.4 E11.5
  Bottom 0.406: E8.5 57.15,66.04 v48.26,62.23
MB2_L
  Bottom 0.406: E3.1 16.51,102.87 16.51,90.17 19.05,87.63 24.13,87.63 29.21,83.82 64.77,83.82 68.58,80.01 68.58,76.2 67.31,74.93 66.04,74.93 E8.6 E11.9 E11.10 58.42,63.5 E11.12 E11.13
MB3_H
  Top 0.406: E8.9 64.77,81.28 74.93,81.28 76.2,80.01 80.01,80.01 E7.13
  Bottom 0.406: E7.9 E7.10 87.63,80.01 85.09,80.01 E7.12 E7.13
MB3_L
  Top 0.406: E5.1 46.99,87.63 40.64,87.63 39.37,88.9 27.94,88.9 20.32,81.28 20.32,78.74 22.86,76.2 62.23,76.2 E8.8 67.31,78.74 88.9,78.74 90.17,77.47 90.17,74.93 E7.5
  Bottom 0.406: E7.5 E7.4 83.82,76.2 E7.2 E7.1
MEM2  (via drill 0.81)
  Top 0.406: v58.42,7.62 74.93,7.62 78.74,5.08 96.52,5.08 102.87,11.43 102.87,12.7 106.68,16.51 117.73,16.51 U$1.BR1
  Bottom 0.406: R1.1 33.02,2.54 55.88,2.54 58.42,5.08 v58.42,7.62 E17.4
MEM_ENABL
  Bottom 0.406: U$1.BU2 116.84,7.62 111.76,7.62 97.79,2.54 62.23,2.54 60.96,3.81 E17.5
MQ2_H
  Top 0.406: U$1.BH1 117.73,39.37 106.68,39.37 104.14,40.64 101.6,40.64 99.06,43.18 71.12,43.18 69.85,41.91 69.85,40.64 82.55,27.94 86.36,27.94 E16.9
MQ3_H  (via drill 0.81)
  Top 0.406: v107.95,27.94 v107.95,22.86
  Bottom 0.406: E12.9 33.02,59.69 27.94,59.69 19.05,54.61 19.05,52.07 20.32,50.8 22.86,50.8 34.29,43.18 38.1,43.18 40.64,40.64 49.53,38.1 66.04,38.1 71.12,34.29 74.93,34.29 77.47,31.75 104.14,31.75 v107.95,27.94 | U$1.BN2 116.84,22.86 v107.95,22.86
MQ_ENABL  (via drill 0.81)
  Top 0.406: v46.99,25.4 44.45,25.4 40.64,29.21 40.64,45.72 41.91,46.99 41.91,48.26 v40.64,49.53 40.64,54.61 35.56,59.69 33.02,59.69 E12.10 | v69.85,49.53 99.06,49.53 107.95,41.91 116.84,41.91 U$1.BF1
  Bottom 0.406: E16.10 87.63,24.13 77.47,24.13 74.93,26.67 48.26,26.67 v46.99,25.4 | v40.64,49.53 45.72,44.45 52.07,44.45 v69.85,49.53
N$2
  Top 0.406: E15.12 38.1,52.07 38.1,54.61 35.56,57.15 30.48,57.15 E12.12
N$3
  Bottom 0.406: R3.2 26.67,123.19 27.94,124.46 41.91,124.46 T1.2
N$4
  Top 0.406: E12.11 31.75,58.42 35.56,58.42 39.37,54.61 39.37,50.8 E15.11
N$5
  ECO 0.406: E16.8 74.93,33.02 E14.8
  Bottom 0.406: E14.8 69.85,39.37 77.47,39.37 78.74,40.64 E13.14
N$6
  Top 0.406: E16.11 71.12,38.1 62.23,38.1 E14.11
N$7
  Top 0.406: E16.12 69.85,36.83 60.96,36.83 E14.12
N$8  (via drill 0.81)
  Top 0.406: E15.8 v39.37,46.99 | v76.2,41.91 E13.2
  ECO 0.406: v39.37,46.99 E12.8
  Bottom 0.406: v39.37,46.99 44.45,43.18 68.58,43.18 71.12,40.64 74.93,40.64 v76.2,41.91
N$9
  Top 0.406: E2.12 53.34,115.57 49.53,115.57 46.99,113.03 46.99,107.95 50.8,104.14 63.5,104.14 67.31,100.33 67.31,97.79 64.77,97.79 E5.9
  Bottom 0.406: E5.9 63.5,100.33 62.23,101.6 57.15,101.6 55.88,100.33 E5.12 55.88,97.79 55.24,97.16 34.92,97.16 34.29,97.79 E6.9
N$10
  Top 0.406: E1.12 83.82,127 82.55,128.27 44.45,128.27 E3.9 | E6.12 38.1,109.22 38.1,111.76 35.56,114.3 30.48,114.3 E3.12
  Bottom 0.406: E3.12 29.21,115.57 31.75,115.57 E3.9
N$11
  Top 0.406: E2.11 63.5,114.3 68.58,114.3 73.66,110.49 73.66,107.95 68.58,102.87 68.58,97.79 67.31,96.52 63.5,96.52 E5.10
  Bottom 0.406: E5.10 E5.11 58.42,97.79 56.52,95.89 32.38,95.89 31.75,96.52 E6.10
N$12  (via drill 0.81)
  Top 0.406: v99.06,22.86 v99.06,35.56
  Bottom 0.406: E17.8 69.85,22.86 72.39,16.51 72.39,12.7 76.2,7.62 78.74,6.35 90.17,6.35 96.52,12.7 96.52,19.05 v99.06,22.86 | E13.13 83.82,39.37 95.25,39.37 v99.06,35.56
N$13
  Top 0.406: E3.11 40.64,129.54 83.82,129.54 86.36,127 E1.11 | E6.11 39.37,109.22 39.37,111.76 35.56,115.57 34.29,115.57 E3.10
  Bottom 0.406: E3.10 E3.11
N$14  (via drill 0.81)
  Top 0.406: v92.71,25.4 E13.3 | v40.64,21.59 v45.72,21.59
  Bottom 0.406: E18.8 v40.64,21.59 | v92.71,25.4 77.47,25.4 74.93,27.94 46.99,27.94 44.45,25.4 44.45,24.13 45.72,22.86 v45.72,21.59
NO_SHIFT  (via drill 0.81)
  Top 0.406: v72.39,109.22 71.12,107.95 58.42,107.95 E2.3 | U$1.AE1 116.84,115.57 110.49,115.57 109.22,116.84 97.79,116.84 95.25,114.3 85.09,114.3 E1.2
  Bottom 0.406: E1.2 80.01,109.22 v72.39,109.22
PC2_H  (via drill 0.81)
  Top 0.406: U$1.AP1 116.84,90.17 109.22,90.17 106.68,92.71 105.41,92.71 99.06,86.36 74.93,86.36 71.12,87.63 68.58,86.36 52.07,86.36 46.99,82.55 43.18,82.55 v39.37,78.74 | E9.5 31.75,67.31 38.1,62.23 39.37,60.96 39.37,57.15 43.18,53.34 43.18,45.72 41.91,44.45 41.91,30.48 45.72,26.67 48.26,26.67 48.26,17.78 v45.72,15.24
  Bottom 0.406: E9.5 31.75,74.93 34.29,77.47 38.1,77.47 v39.37,78.74 | E17.2 50.8,12.7 48.26,12.7 v45.72,15.24
PC2_L  (via drill 0.81)
  Top 0.406: v43.18,78.74 52.07,85.09 68.58,85.09 71.12,86.36 74.93,85.09 99.06,85.09 100.33,86.36 v106.68,86.36
  Bottom 0.406: U$1.AR2 117.17,86.69 116.84,86.36 v106.68,86.36 | E9.6 34.29,74.93 35.56,76.2 40.64,76.2 v43.18,78.74
PC3_H  (via drill 0.81)
  Top 0.406: v39.37,66.04 v39.37,69.85 | U$1.AN1 116.84,92.71 110.49,92.71 107.95,95.25 104.14,95.25 97.79,88.9 74.93,88.9 71.12,90.17 68.58,88.9 52.07,88.9 46.99,85.09 39.37,85.09 E9.9 | E18.2 19.05,19.05 19.05,44.45 v20.32,45.72
  Bottom 0.406: E9.9 35.56,81.28 43.18,81.28 45.72,78.74 45.72,76.2 v39.37,69.85 | v39.37,66.04 38.1,67.31 20.32,67.31 16.51,62.23 16.51,49.53 v20.32,45.72
PC3_L  (via drill 0.81)
  Top 0.406: v105.41,93.98 99.06,87.63 74.93,87.63 71.12,88.9 68.58,87.63 52.07,87.63 46.99,83.82 40.64,83.82 E9.8
  Bottom 0.406: U$1.AP2 117.17,89.84 116.84,90.17 109.22,90.17 v105.41,93.98
PC_ENABL  (via drill 0.81)
  Top 0.406: v55.88,6.35 v72.39,6.35
  Bottom 0.406: U$1.BS2 116.84,13.97 111.76,13.97 105.41,8.89 97.79,5.08 76.2,5.08 v72.39,6.35 | 55.88,11.43 v55.88,6.35 | 55.88,11.43 E17.3 | E18.3 29.21,12.7 41.91,12.7 43.18,11.43 55.88,11.43
SC2
  Top 0.406: E14.2 48.26,39.37 48.26,43.18 50.8,45.72 50.8,49.53 52.07,50.8 95.25,50.8 96.52,52.07 100.33,52.07 105.41,46.99 109.22,46.99 110.49,48.26 116.84,48.26 U$1.BD1
SC3  (via drill 0.81)
  Top 0.406: E15.2 24.13,27.94 26.67,25.4 36.83,25.4 39.37,22.86 39.37,20.32 43.18,16.51 43.18,15.24 44.45,13.97 46.99,13.97 50.8,17.78 67.31,17.78 68.58,16.51 v69.85,16.51 | U$1.BN1 117.71,22.86 110.49,22.86 109.22,21.59 102.87,21.59 100.33,19.05 69.85,19.05 v68.58,20.32
  Bottom 0.406: v69.85,16.51 v68.58,20.32
SC_ENABL  (via drill 0.81)
  Top 0.406: v34.29,30.48 30.48,30.48 E15.3 | E14.3 49.53,40.64 49.53,43.18 53.34,46.99 97.79,46.99 v102.87,43.18
  Bottom 0.406: E14.3 52.07,30.48 v34.29,30.48 | U$1.BF2 116.84,41.91 111.76,41.91 109.22,43.18 v102.87,43.18
SHIFT_L1  (via drill 0.81)
  Top 0.406: v100.33,111.76 97.79,109.22 90.17,109.22 E1.5
  Bottom 0.406: E1.5 88.9,113.03 86.36,115.57 55.88,115.57 E2.13 | U$1.AF2 115.85,112.04 115.57,111.76 109.22,111.76 106.68,109.22 102.87,109.22 v100.33,111.76
SHIFT_L2  (via drill 0.81)
  Top 0.406: E5.8 62.23,102.87 50.8,102.87 44.45,109.22 v44.45,113.03 | U$1.AH1 116.84,109.22 109.22,109.22 105.41,105.41 v99.06,105.41
  Bottom 0.406: E3.8 39.37,118.11 v44.45,113.03 | E5.8 72.39,100.33 76.2,104.14 80.01,104.14 81.28,105.41 v99.06,105.41
SHIFT_R1  (via drill 0.81)
  Top 0.406: v102.87,118.11 97.79,118.11 95.25,115.57 83.82,115.57 E1.1 | v68.58,110.49 67.31,109.22 62.23,109.22 E2.5
  Bottom 0.406: U$1.AD2 117.14,118.42 116.84,118.11 v102.87,118.11 | v68.58,110.49 E1.1
SHIFT_R2  (via drill 0.81)
  Top 0.406: U$1.AD1 115.88,118.42 115.57,118.11 111.76,118.11 110.49,119.38 92.71,119.38 E1.9 | v73.66,119.38 71.12,121.92 67.31,121.92 E2.9
  Bottom 0.406: E1.9 91.44,119.38 88.9,121.92 76.2,121.92 v73.66,119.38
SR2  (via drill 0.81)
  Top 0.406: E14.13 57.15,45.72 v96.52,45.72 | U$1.BE1 116.84,45.72 105.41,45.72 v99.06,50.8
  Bottom 0.406: v96.52,45.72 v99.06,50.8
SR3
  Bottom 0.406: E15.13 25.4,45.72 24.13,48.26 20.32,48.26 17.78,50.8 17.78,60.96 20.32,63.5 36.83,63.5 44.45,60.96 48.26,57.78 99.69,57.78 102.87,54.61 102.87,50.8 105.41,48.26 116.84,48.26 U$1.BD2
SR_ENABL
  Top 0.406: E14.1 46.99,38.1 46.99,43.18 49.53,45.72 49.53,49.53 52.07,52.07 95.25,52.07 96.52,53.34 100.33,53.34 105.41,48.26 106.68,48.26 111.76,52.07 116.84,52.07 U$1.BC1
  Bottom 0.406: E14.1 49.53,34.29 36.83,36.83 24.13,36.83 E15.1
TT_SHIFT  (via drill 0.81)
  Top 0.406: E6.13 R5.1 | T1.3 40.64,114.3 v40.64,102.87 E6.8
  Bottom 0.406: R5.1 22.86,102.87 v40.64,102.87
VCC  (via drill 0.81)
  Top 0.813: R4.2 13.97,124.46 13.97,121.92 C8.+ 8.89,116.84 8.89,99.06 | 8.89,99.06 E6.14 | 8.89,99.06 8.89,78.74 C7.+ 15.24,72.39 15.24,60.96 | C4.+ 99.06,20.32 96.52,20.32 | 96.52,20.32 81.28,20.32 E16.14 | E2.14 55.88,123.19 73.66,123.19 E1.14 | v21.59,64.77 E12.14 15.24,60.96 | C6.+ 15.24,53.34 15.24,60.96 | v27.94,82.55 24.13,82.55 E9.14 | v72.39,102.87 E4.14 | E7.14 77.47,82.55 68.58,82.55 67.31,83.82 54.61,83.82 E8.14 | E15.14 v31.75,49.53 | E13.4 96.52,24.13 96.52,20.32
  Bottom 0.813: R2.2 R1.2 11.43,7.62 10.16,8.89 10.16,16.51 C5.+ | C5.+ 10.16,29.21 10.16,48.26 C6.+ 12.7,45.72 16.51,41.91 E15.14 | C5.+ E18.14 24.13,25.4 40.64,25.4 43.18,22.86 43.18,21.59 44.45,20.32 48.26,20.32 E17.14 52.7,24.77 74.3,24.77 76.2,22.86 E16.14 | C8.+ E3.14 25.4,121.92 27.94,121.92 29.21,123.19 40.64,123.19 45.72,118.11 E2.14 | U$1.AA2 116.84,128.27 111.76,128.27 C1.+ 100.33,130.81 20.32,130.81 R4.2 | C7.+ E9.14 | R6.2 41.91,105.41 43.18,104.14 43.18,102.87 41.91,101.6 | 41.91,101.6 24.13,101.6 E6.14 | 41.91,101.6 41.91,99.06 42.55,98.42 50.16,98.42 E5.14 54.61,102.87 v72.39,102.87 | C2.+ 95.25,86.36 83.82,86.36 E7.14 | E8.14 48.26,82.55 v27.94,82.55 | U$1.BA2 117.24,58.02 116.84,58.42 109.22,58.42 105.41,62.23 C3.+ 102.87,66.04 95.89,59.05 80.64,59.05 E10.14 76.83,59.05 52.7,59.05 E11.14 49.53,59.69 48.26,59.69 45.72,62.23 36.83,64.77 v21.59,64.77 | E14.14 44.45,41.91 38.1,45.72 34.29,49.53 v31.75,49.53

### Text on the board
Bottom: M220B
tPlace: Do not manufacture ECO layers. | ebc